# EAGLE design NotNightVision_r001 (EAGLE 7.5.0)
AUTHOR: Joshua Alexander; REVISION: 001

## Sheet 1 of 2
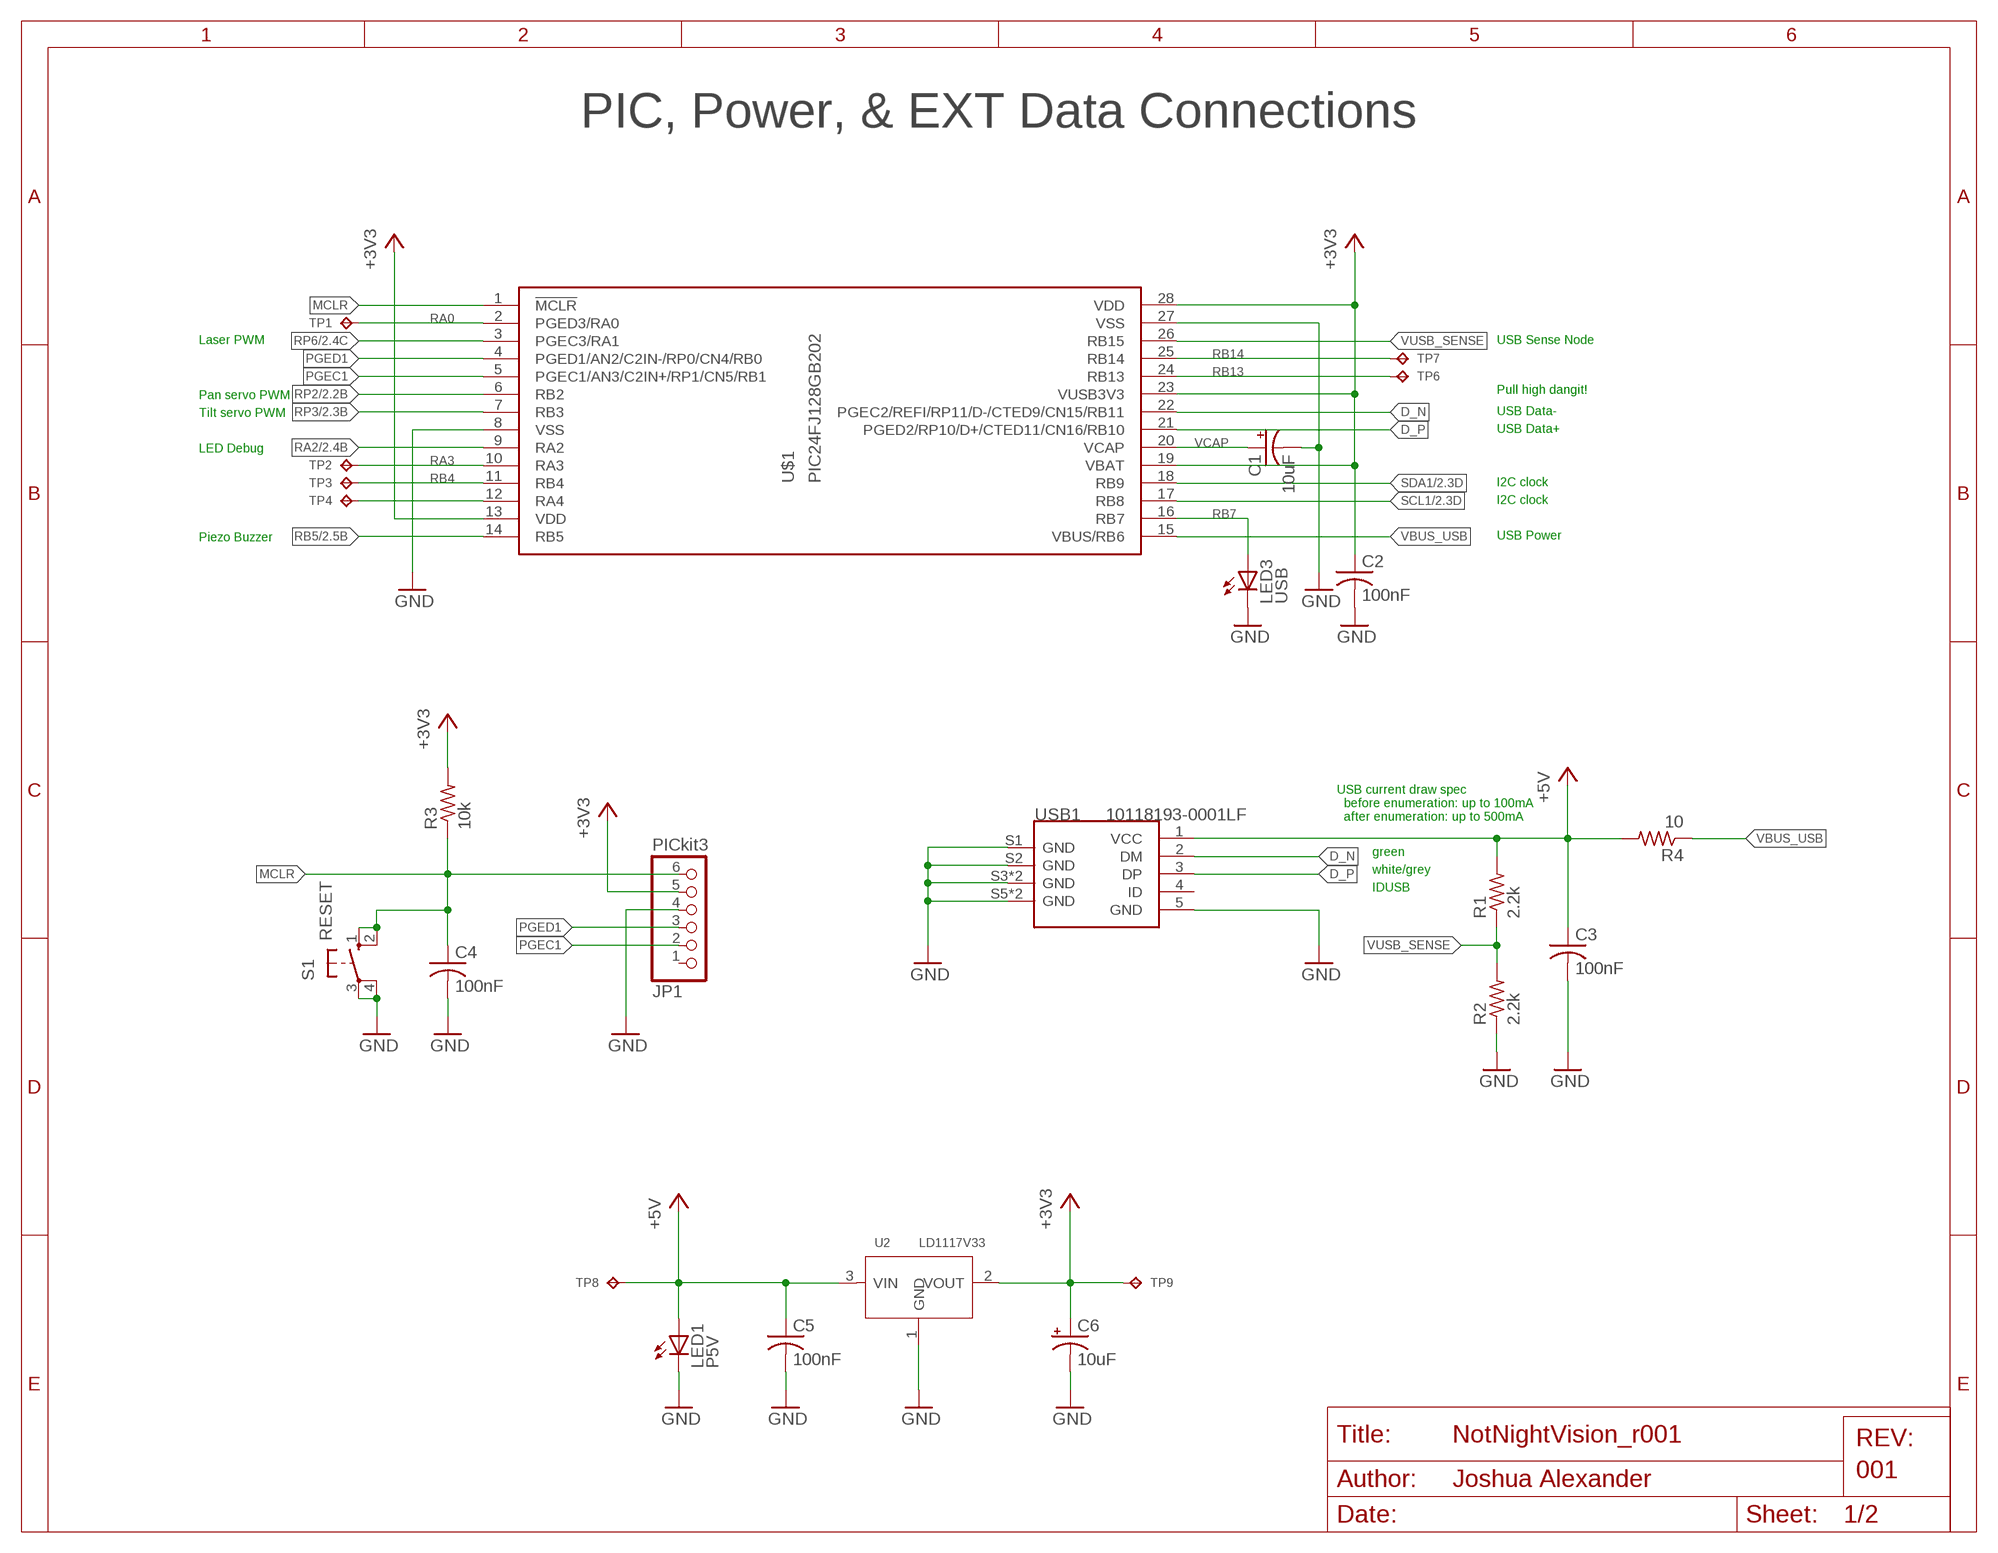
[diagram p0: schematic, sheet 1]

### Parts
C1  10uF  CPOL-USTT5D10  [TT5D10]
C2  100nF  C-US025-025X050  [C025-025X050]
C3  100nF  C-US025-025X050  [C025-025X050]
C4  100nF  C-US025-025X050  [C025-025X050]
C5  100nF  C-US025-025X050  [C025-025X050]
C6  10uF  CPOL-USTT5D10  [TT5D10]
JP1  PICkit3  PINHD-1X6/90  [1X06/90]
LED1  P5V  LED5MM  [LED5MM]
LED3  USB  LED3MM  [LED3MM]
R1  2.2k  R-US_0207/7  [0207/7]
R2  2.2k  R-US_0207/7  [0207/7]
R3  10k  R-US_0207/7  [0207/7]
R4  10  R-US_0207/7  [0207/7]
S1  RESET  10-XX  [B3F-10XX]
TP1  TP10  [10MIL_ROUND]
TP2  TP10  [10MIL_ROUND]
TP3  TP10  [10MIL_ROUND]
TP4  TP10  [10MIL_ROUND]
TP6  TP10  [10MIL_ROUND]
TP7  TP10  [10MIL_ROUND]
TP8  TP10  [10MIL_ROUND]
TP9  TP10  [10MIL_ROUND]
U2  LD1117V33  LD1117V33TO220V  [TO-220V]
U$1  PIC24FJ128GB202  [DIL28-3]
USB1  10118193-0001LF  MICRO-USB-SMD-B-(10118193-0001LF)  [MICRO-USB5+6P-SMD-0.65-B]

### Nets
+3V3 [power]: C2.1 C6.+ JP1.5 R3.2 TP9.TP U2.2(VOUT) U$1.13(VDD) U$1.19(VBAT) U$1.23(VUSB3V3) U$1.28(VDD) ; also sheet 2
+5V [power]: C3.1 C5.1 LED1.A R1.2 R4.2 TP8.TP U2.3(VIN) USB1.1(VCC) ; also sheet 2
D_N [usb]: U$1.22(PGEC2/REFI/RP11/D-/CTED9/CN15/RB11) USB1.2(DM)
D_P [usb]: U$1.21(PGED2/RP10/D+/CTED11/CN16/RB10) USB1.3(DP)
GND [power]: C1.- C2.2 C3.2 C4.2 C5.2 C6.- JP1.4 LED1.K(C) LED3.K(C) R2.1 S1.3(P) S1.4(P1) U2.1(GND) U$1.8(VSS) U$1.27(VSS) USB1.5(GND) USB1.S1(GND) USB1.S2(GND) USB1.S3(GND) USB1.S4(GND) USB1.S5(GND) USB1.S6(GND) ; also sheet 2
MCLR: C4.1 JP1.6 R3.1 S1.1(S) S1.2(S1) U$1.1(!MCLR)
PGEC1: JP1.2 U$1.5(PGEC1/AN3/C2IN+/RP1/CN5/RB1)
PGED1: JP1.3 U$1.4(PGED1/AN2/C2IN-/RP0/CN4/RB0)
RA0: TP1.TP U$1.2(PGED3/RA0)
RA2: U$1.9(RA2) ; also sheet 2
RA3: TP2.TP U$1.10(RA3)
RA4: TP4.TP U$1.12(RA4)
RB4: TP3.TP U$1.11(RB4)
RB5: U$1.14(RB5) ; also sheet 2
RB7: LED3.A U$1.16(RB7)
RB13: TP6.TP U$1.24(RB13)
RB14: TP7.TP U$1.25(RB14)
RP2: U$1.6(RB2) ; also sheet 2
RP3: U$1.7(RB3) ; also sheet 2
RP6: U$1.3(PGEC3/RA1) ; also sheet 2
SCL1: U$1.17(RB8) ; also sheet 2
SDA1: U$1.18(RB9) ; also sheet 2
VBUS_USB: R4.1 U$1.15(VBUS/RB6)
VCAP: C1.+ U$1.20(VCAP)
VUSB_SENSE: R1.1 R2.2 U$1.26(RB15)
Unconnected: JP1.1 USB1.4(ID)

### Notes on the sheet
- Laser PWM | USB Sense Node
- Pull high dangit!
- Pan servo PWM
- Tilt servo PWM | USB Data-
- USB Data+
- LED Debug
- I2C clock
- I2C clock
- Piezo Buzzer | USB Power
- USB current draw spec
    before enumeration: up to 100mA
    after enumeration: up to 500mA
- green
- white/grey
- IDUSB

## Sheet 2 of 2
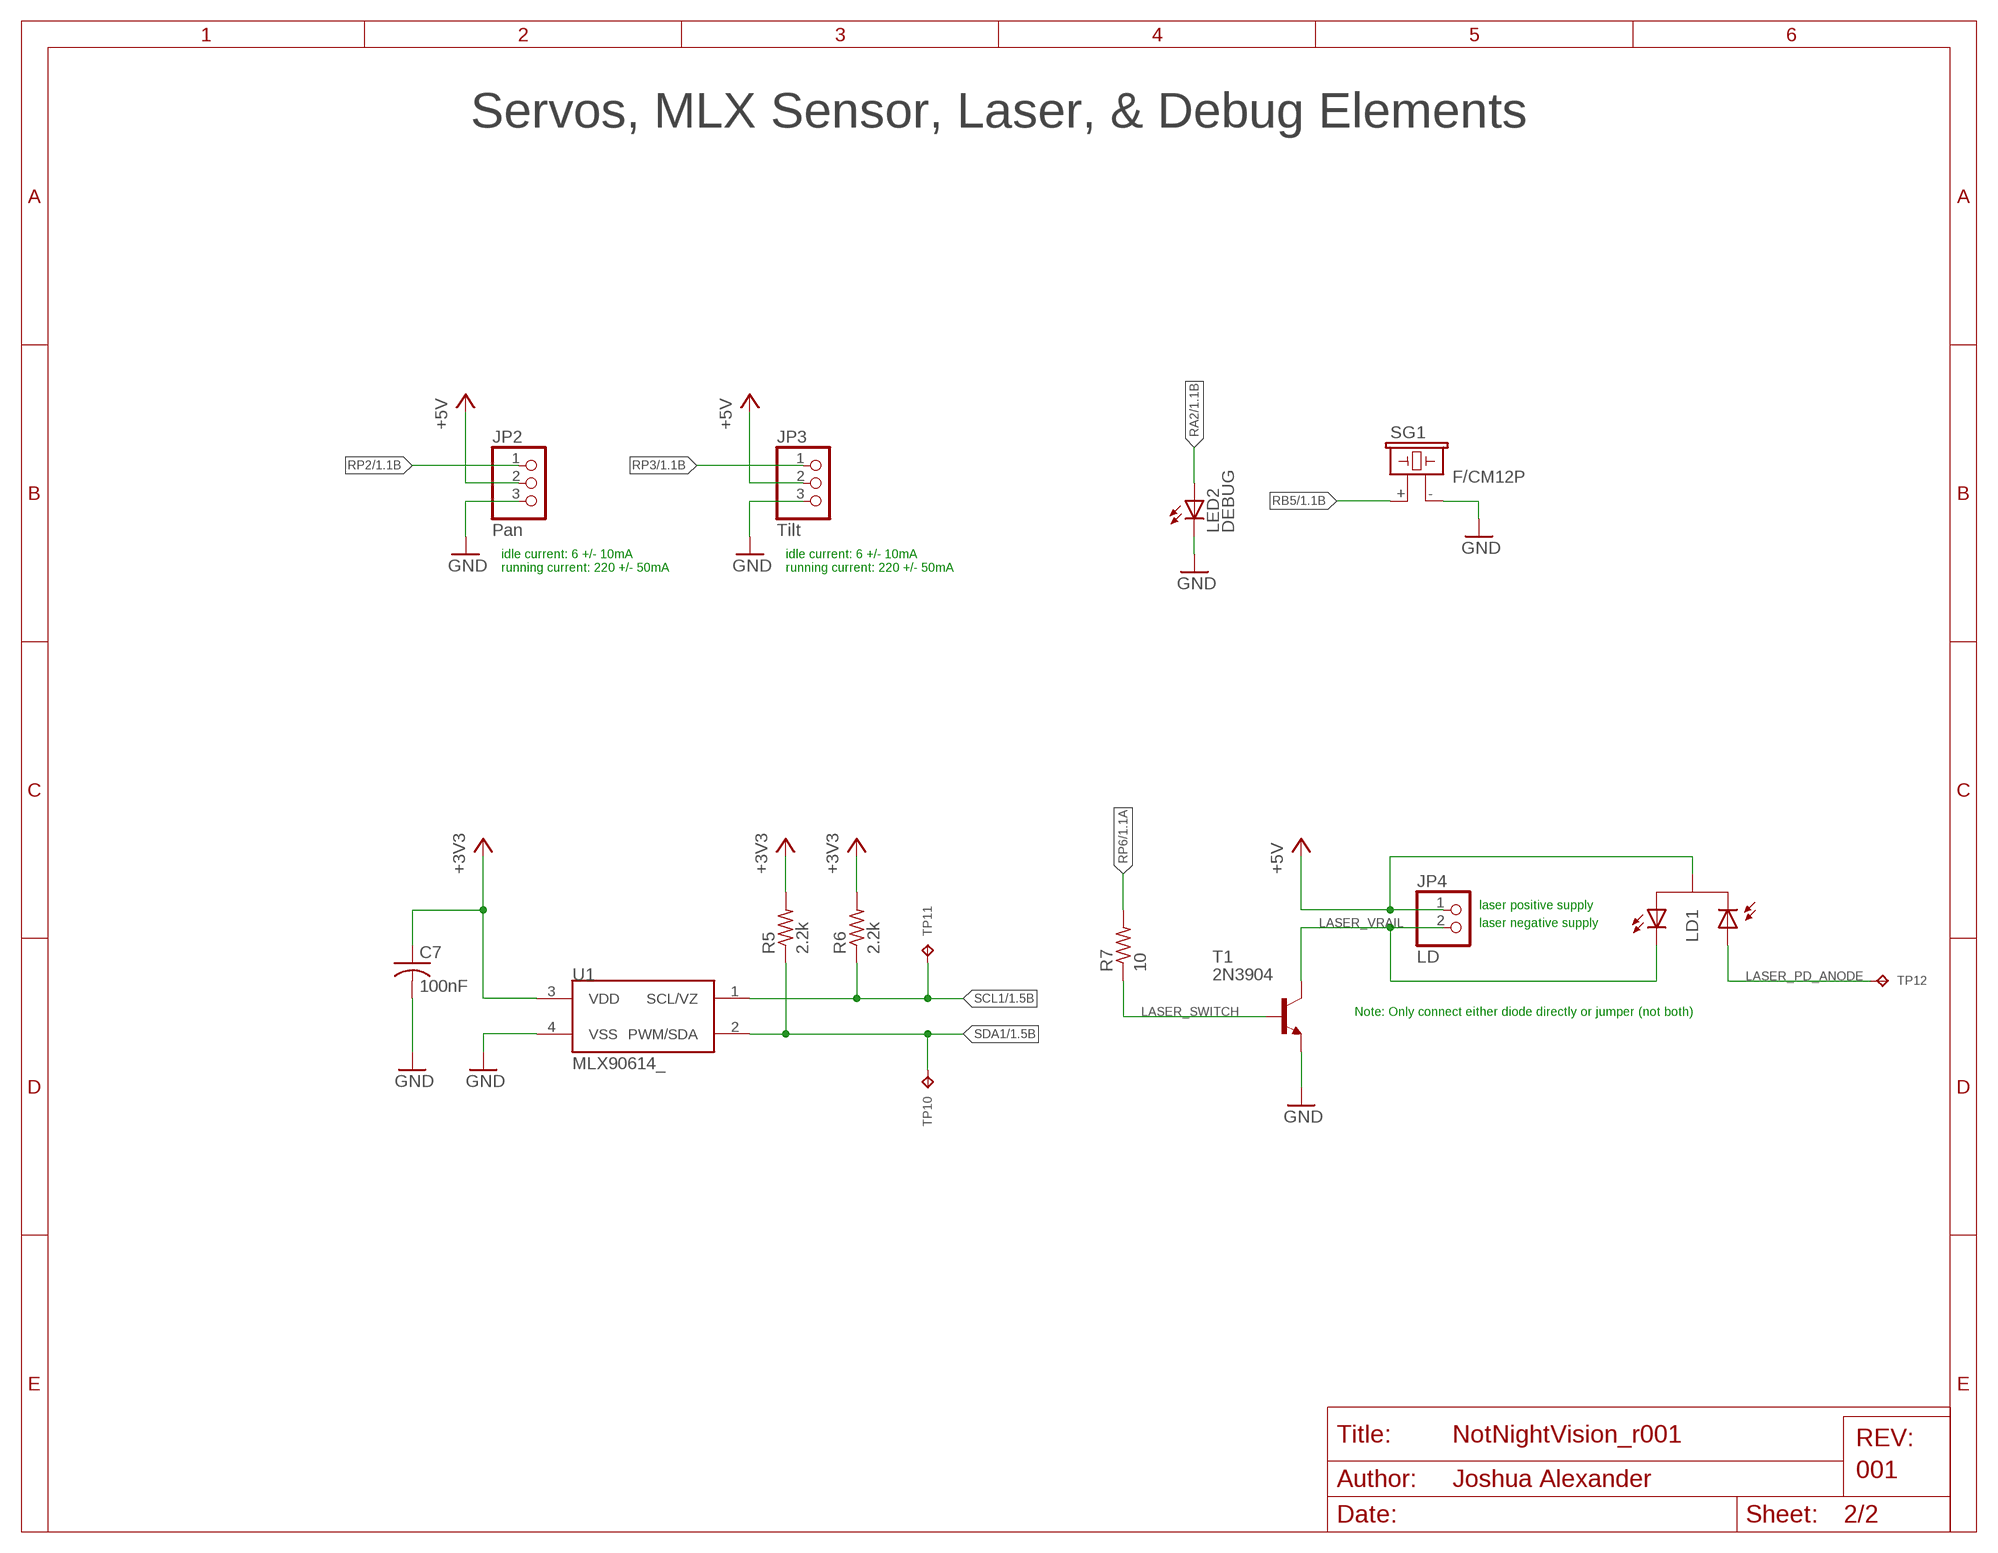
[diagram p1: schematic, sheet 2]

### Parts
C7  100nF  C-US025-025X050  [C025-025X050]
JP2  Pan  PINHD-1X3  [1X03]
JP3  Tilt  PINHD-1X3  [1X03]
JP4  LD  PINHD-1X2  [1X02]
LD1  LASER_DIODE  [TO-18]
LED2  DEBUG  LED3MM  [LED3MM]
R5  2.2k  R-US_0207/7  [0207/7]
R6  2.2k  R-US_0207/7  [0207/7]
R7  10  R-US_0207/7  [0207/7]
SG1  F/CM12P  [F/CM12P]
T1  2N3904  [TO92]
TP10  TP10  [10MIL_ROUND]
TP11  TP10  [10MIL_ROUND]
TP12  TP10  [10MIL_ROUND]
U1  MLX90614_  [TO-39]

### Nets
+3V3 [power]: C7.1 R5.2 R6.2 U1.3(VDD) ; also sheet 1
+5V [power]: JP2.2 JP3.2 JP4.1 LD1.2(V) ; also sheet 1
GND [power]: C7.2 JP2.3 JP3.3 LED2.K(C) SG1.- T1.3(E) U1.4(VSS) ; also sheet 1
LASER_PD_ANODE: LD1.3(D+) TP12.TP
LASER_SWITCH: R7.1 T1.2(B)
LASER_VRAIL: JP4.2 LD1.1(D-) T1.1(C)
RA2: LED2.A ; also sheet 1
RB5: SG1.+ ; also sheet 1
RP2: JP2.1 ; also sheet 1
RP3: JP3.1 ; also sheet 1
RP6: R7.2 ; also sheet 1
SCL1: R6.1 TP11.TP U1.1(SCL/VZ) ; also sheet 1
SDA1: R5.1 TP10.TP U1.2(PWM/SDA) ; also sheet 1

### Notes on the sheet
- idle current: 6 +/- 10mA
  running current: 220 +/- 50mA
- idle current: 6 +/- 10mA
  running current: 220 +/- 50mA
- laser positive supply
- laser negative supply
- Note: Only connect either diode directly or jumper (not both)

## Library data of the parts
C1 C6 = rcl:CPOL-US: POLARIZED CAPACITOR, American symbol; OC_NEWARK: unknown
C2-C5 C7 = rcl:C-US: CAPACITOR, American symbol; OC_NEWARK: unknown
JP1 = pinhead:PINHD-1X6: PIN HEADER
JP2 JP3 = pinhead:PINHD-1X3: PIN HEADER
JP4 = pinhead:PINHD-1X2: PIN HEADER
LD1 = custom:LASER_DIODE
LED1-LED3 = led:LED: LED OSRAM: - CHIPLED LG R971, LG N971, LY N971, LG Q971, LY Q971, LO R971, LY R971 LH N974, LH R974 LS Q976, LO Q976, LY Q976 LO Q996 - Hyper CHIPLED LW Q18S LB Q993, LB Q99A, LB R99A - SideLED LS A670, LO A670, LY A670, LG A670, LP A670 LB A673, LV A673, LT A673, LW A673 LH A674 LY A675 LS A676, LA A676, LO A676, LY A676, LW A676 LS A679, LY A679, LG A679 - Hyper Micro SIDELED® LS Y876, LA Y876, LO Y876, LY Y876 LT Y87S - SmartLED LW L88C, LW L88S LB L89C, LB L89S, LG L890 LS L89K, LO L89K, LY L89K LS L896, LA L896, LO L896, LY L896 - TOPLED LS T670, LO T670, LY T670, LG T670, LP T670 LSG T670, LSP T670, LSY T670, LOP T670, LYG T670 LG T671, LOG T671, LSG T671 LB T673, LV T673, LT T673, LW T673 LH T674 LS T676, LA T676, LO T676, LY T676, LB T676, LH T676, LSB T676, LW T676 LB T67C, LV T67C, LT T67C, LS T67K, LO T67K, LY T67K, LW E67C LS E67B, LA E67B, LO E67B, LY E67B, LB E67C, LV E67C, LT E67C LW T67C LS T679, LY T679, LG T679 LS T770, LO T770, LY T770, LG T770, LP T770 LB T773, LV T773, LT T773, LW T773 LH T774 LS E675, LA E675, LY E675, LS T675 LS T776, LA T776, LO T776, LY T776, LB T776 LHGB T686 LT T68C, LB T68C - Hyper Mini TOPLED® LB M676 - Mini TOPLED Santana® LG M470 LS M47K, LO M47K, LY M47K Source: http://www.osram.convergy.de LUXEON: - LUMILED® LXK2-PW12-R00, LXK2-PW12-S00, LXK2-PW14-U00, LXK2-PW14-V00 LXK2-PM12-R00, LXK2-PM12-S00, LXK2-PM14-U00 LXK2-PE12-Q00, LXK2-PE12-R00, LXK2-PE12-S00, LXK2-PE14-T00, LXK2-PE14-U00 LXK2-PB12-K00, LXK2-PB12-L00, LXK2-PB12-M00, LXK2-PB14-N00, LXK2-PB14-P00, LXK2-PB14-Q00 LXK2-PR12-L00, LXK2-PR12-M00, LXK2-PR14-Q00, LXK2-PR14-R00 LXK2-PD12-Q00, LXK2-PD12-R00, LXK2-PD12-S00 LXK2-PH12-R00, LXK2-PH12-S00 LXK2-PL12-P00, LXK2-PL12-Q00, LXK2-PL12-R00 Source: www.luxeon.com KINGBRIGHT: KA-3528ASYC Source: www.kingbright.com
R1-R7 = rcl:R-US_: RESISTOR, American symbol; OC_NEWARK: unknown
S1 = switch-omron:10-XX: OMRON SWITCH; MPN: B3F-1000; OC_FARNELL: 176432; OC_NEWARK: 36M3542
SG1 = buzzer:F/CM12P: BUZZER Source: Buerklin; OC_FARNELL: unknown; OC_NEWARK: unknown
T1 = transistor:2N3904: NPN TRANSISTOR
TP1-TP4 TP6-TP12 = custom:TP: Test pad
U1 = SparkFun-Sensors:MLX90614: Non-contact PIR I2C interface temperature sensor; MPN: 1747; OC_NEWARK: 28Y4967
U2 = custom:LD1117V33: 310030025
U$1 = custom:PIC24FJ128GB202; OC_NEWARK: unknown
USB1 = Seeed-OPL-Connector:MICRO-USB-SMD-B-(10118193-0001LF): 320010003; MPN: 10118193-0001LF; OC_NEWARK: 67T2259

## Net classes
0 default: width 0.203 mm, drill 0.381 mm, clearance 0.203 mm
1 power: width 0.381 mm, drill 0.381 mm, clearance 0.203 mm
2 usb: width 0.191 mm, drill 0.381 mm, clearance 0.203 mm

## Board
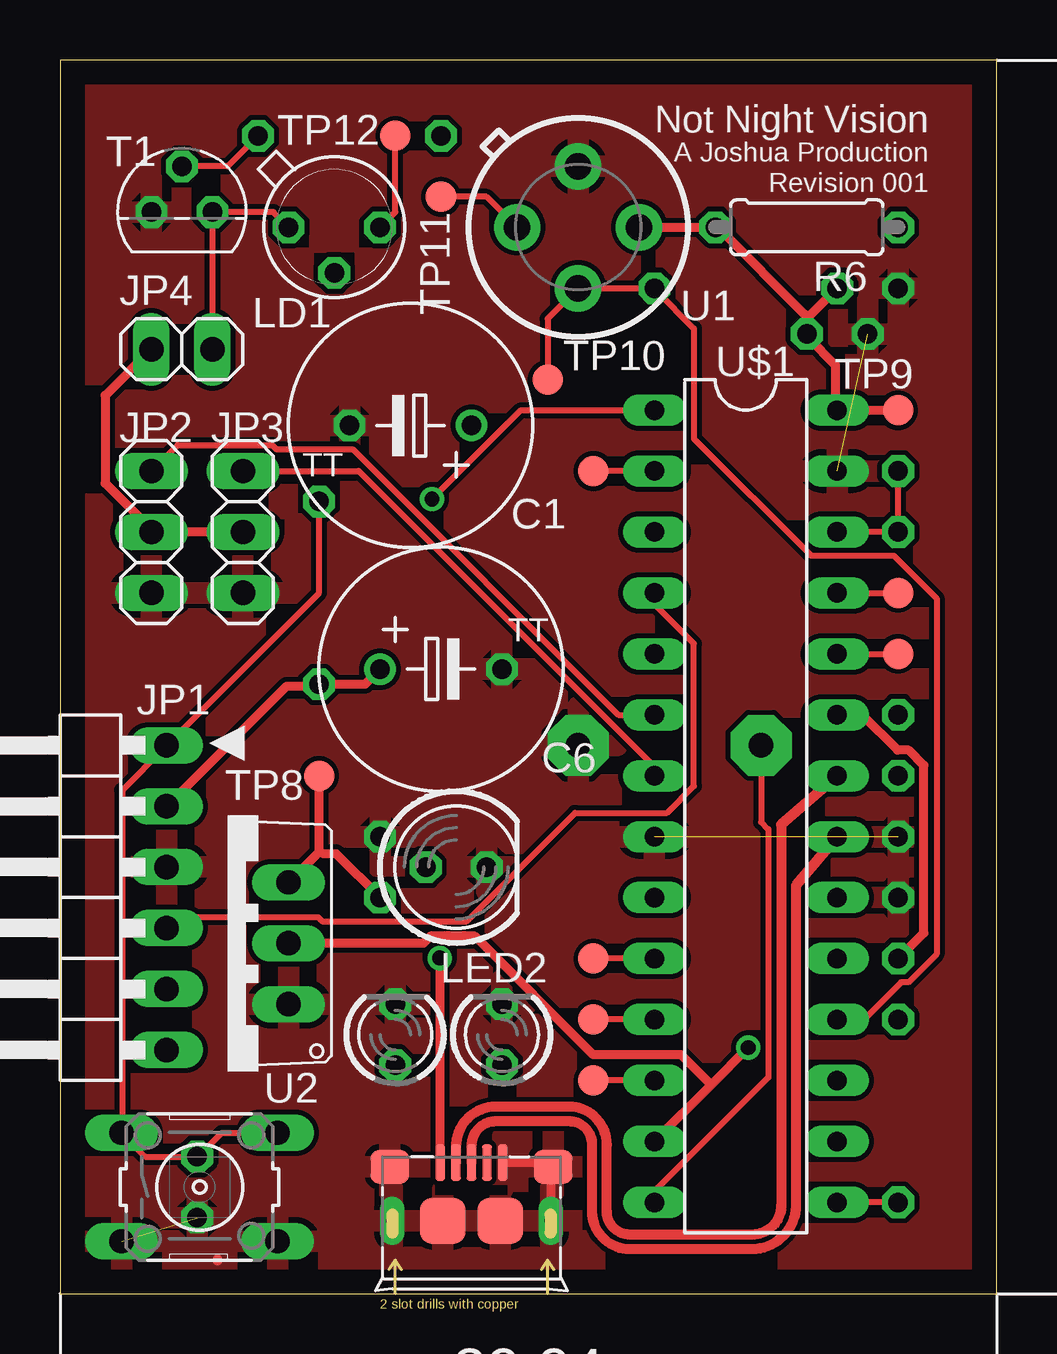
[diagram p2: board, top side]
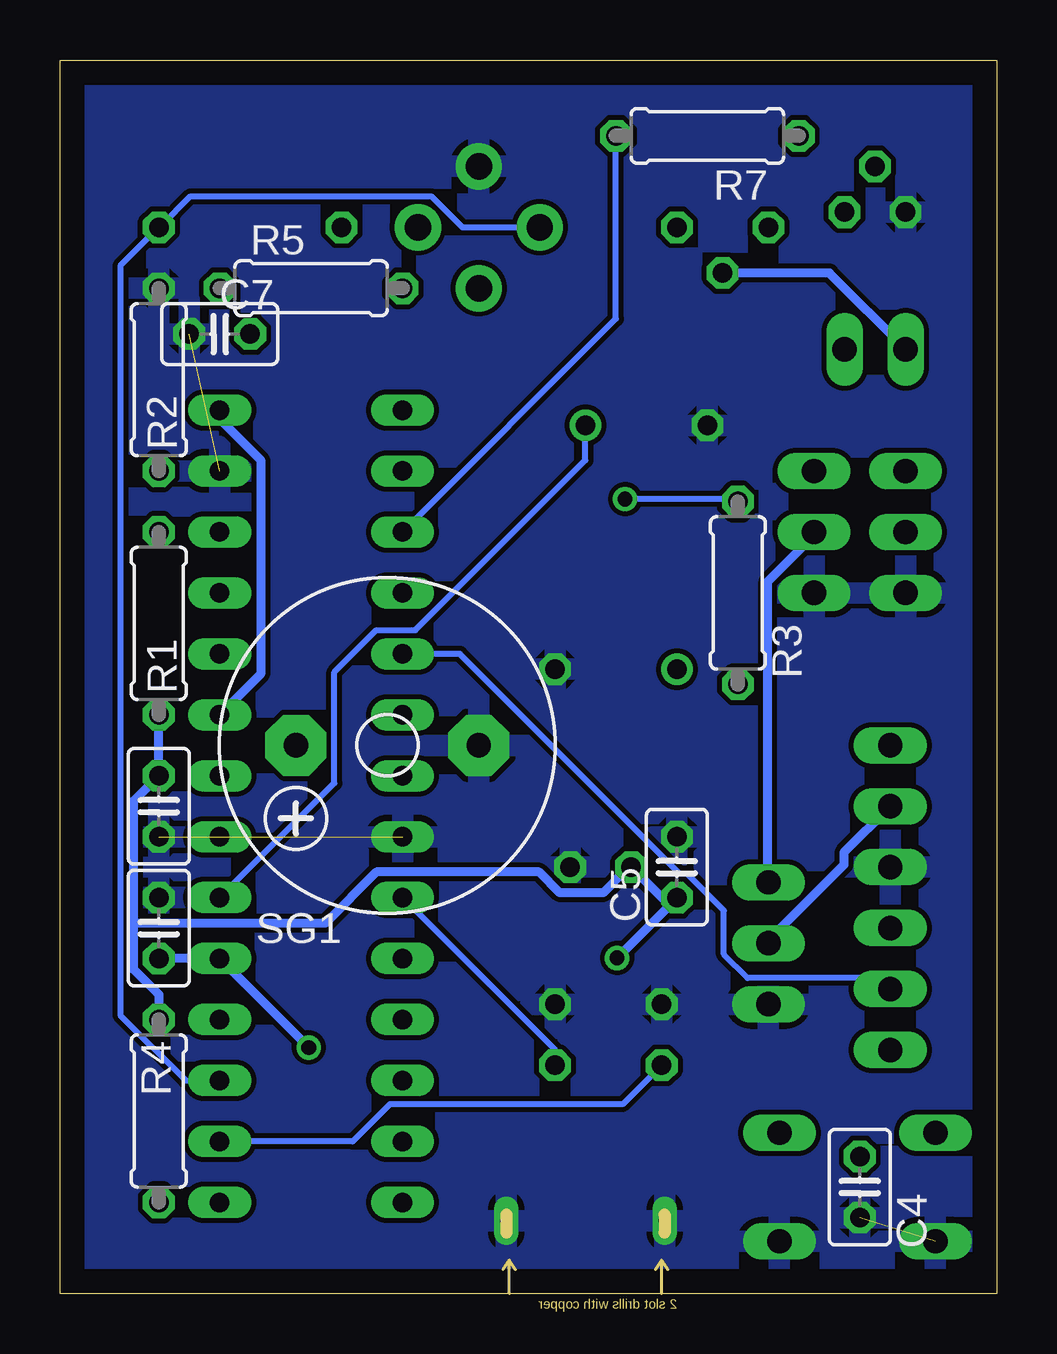
[diagram p3: board, bottom side, seen from below]

Size 39.04 x 51.42 mm. Coordinates in mm from the lower left corner, seen from the top.
Outline: 0,0 39.04,0 39.04,51.42 0,51.42 0,0
Copper layers (1*16): Top 0.035mm / dielectric 1.5mm / Bottom 0.035mm
Design rules "default": minimum track width 10mil, minimum drill 24mil, track to track 8mil, track to pad 8mil, pad to pad 8mil, via to via 8mil, smd to smd 8mil, copper to edge 40mil, drill to drill 8mil, minimum pad ring 10mil, minimum via ring 8mil, stop-mask expansion 4mil, vias tented up to drill 0mil, thermal gap 10mil

### Footprints (pad centres in the part's own frame; a part is rotated, then mirrored left to right if it is on the bottom)
TT5D10 = drill 0.813: + -2.54,0 | drill 0.813 octagon: - 2.54,0
C025-025X050 = drill 0.813 octagon: 1 -1.27,0; 2 1.27,0
1X06/90 = drill 1.016 long: 1 -6.35,-3.81; 2 -3.81,-3.81; 3 -1.27,-3.81; 4 1.27,-3.81; 5 3.81,-3.81; 6 6.35,-3.81
1X03 = drill 1.016 long: 1 -2.54,0; 2 0,0; 3 2.54,0
1X02 = drill 1.016 long: 1 -1.27,0; 2 1.27,0
TO-18 = drill 0.813 octagon: 1 1.905,0; 2 0,1.905; 3 -1.905,0
LED5MM = drill 0.813 octagon: A -1.27,0; K 1.27,0
LED3MM = drill 0.813 octagon: A -1.27,0; K 1.27,0
0207/7 = drill 0.813 octagon: 1 -3.81,0; 2 3.81,0
B3F-10XX = drill 1.016 long: 1 -3.251,2.261; 2 3.251,2.261; 3 -3.251,-2.261; 4 3.251,-2.261
F/CM12P = drill 1.016 pad 2.54 octagon: + 3.81,0; - -3.81,0
TO92 = drill 0.813 octagon: 1 1.27,0; 2 0,1.905; 3 -1.27,0
10MIL_ROUND = smd 1.27 x 1.27: TP 0,0
TO-39 = drill 1.1 pad 1.93: 1 2.54,0; 2 0,2.54; 3 -2.54,0; 4 0,-2.54
TO-220V = drill 1.016 long: 1 -2.54,-2.54; 2 0,-2.54; 3 2.54,-2.54
DIL28-3 = drill 0.813 long: 1 -16.51,-3.81; 2 -13.97,-3.81; 3 -11.43,-3.81; 4 -8.89,-3.81; 5 -6.35,-3.81; 6 -3.81,-3.81; 7 -1.27,-3.81; 8 1.27,-3.81; 9 3.81,-3.81; 10 6.35,-3.81; 11 8.89,-3.81; 12 11.43,-3.81; 13 13.97,-3.81; 14 16.51,-3.81; 15 16.51,3.81; 16 13.97,3.81; 17 11.43,3.81; 18 8.89,3.81; 19 6.35,3.81; 20 3.81,3.81; 21 1.27,3.81; 22 -1.27,3.81; 23 -3.81,3.81; 24 -6.35,3.81; 25 -8.89,3.81; 26 -11.43,3.81; 27 -13.97,3.81; 28 -16.51,3.81
MICRO-USB5+6P-SMD-0.65-B = smd 0.4 x 1.5: 1 -1.3,-0.25; 2 -0.65,-0.25; 3 0,-0.25; 4 0.65,-0.25; 5 1.3,-0.25 | smd 1.6 x 1.4: S1 -3.4,-0.427; S6 3.4,-0.427 | drill 0.508 pad 1.016 long: S2 -3.3,-2.675; S5 3.3,-2.675 | smd 1.9 x 1.9: S3 -1.2,-2.675; S4 1.2,-2.675

### Placement (x,y rotation side)
C1  14.61,36.2 180 top
C2  34.92,15.24 90 bottom
C3  34.92,20.32 270 bottom
C4  5.71,4.45 270 bottom
C5  13.33,17.78 90 bottom
C6  15.88,26.04 0 top
C7  32.38,40 180 bottom
JP1  0.64,16.51 90 top
JP2  3.81,31.75 270 top
JP3  7.62,31.75 270 top
JP4  5.08,39.37 0 top
LD1  11.43,44.45 180 top
LED1  16.51,17.78 0 top
LED2  18.42,10.79 90 top
LED3  13.97,10.79 90 top
R1  34.92,27.94 270 bottom
R2  34.92,38.1 270 bottom
R3  10.79,29.21 270 bottom
R4  34.92,7.62 90 bottom
R5  28.58,41.91 180 bottom
R6  31.12,44.45 180 top
R7  12.06,48.26 180 bottom
S1  5.82,4.45 0 top
SG1  25.4,22.86 180 bottom
T1  5.08,45.09 0 top
TP1  22.23,34.29 0 top
TP2  22.23,13.97 0 top
TP3  22.23,11.43 0 top
TP4  22.23,8.89 0 top
TP6  34.92,26.67 0 top
TP7  34.92,29.21 0 top
TP8  10.79,21.59 180 top
TP9  34.92,36.83 0 top
TP10  20.32,38.1 0 top
TP11  15.88,45.72 180 top
TP12  13.97,48.26 0 top
U1  21.59,44.45 180 top
U2  6.98,14.61 90 top
U$1  28.58,20.32 270 top
USB1  17.15,5.71 0 top

### Tracks (layer width: path | path; a pad name or v marks a point on that pad's centre or on a via)
+3V3  (via drill 0.61)
  Top 0.381: C6.+ 12.7,25.4 R3.2 10.62,25.32 9.45,25.32 JP1.5 | U1.3 R6.2 27.48,44.37 31.04,40.82 31.12,40.64 | TP9.TP U$1.28 32.31,37.01 32.31,38.71 31.19,39.83 C7.1 31.12,40.64 | R5.2 31.12,40.64 | v28.68,10.26 27.13,8.71 | 27.13,8.71 U$1.13 | U$1.23 33.43,24.13 34.9,22.66 35.36,22.66 35.99,22.02 35.99,15.04 C2.1 | U2.2 15.14,14.61 15.44,14.91 17.27,14.91 22.23,9.96 25.88,9.96 27.13,8.71
  Bottom 0.381: U2.2 9.53,14.73 6.38,17.88 6.38,18.39 JP1.5 | v28.68,10.26 U$1.19 C2.1 | U$1.28 32.38,36.45 30.66,34.72 30.66,25.86 U$1.23
+5V  (via drill 0.61)
  Top 0.381: JP3.2 JP2.2 3.73,31.93 1.88,33.78 1.88,37.44 JP4.1 | 10.79,18.42 TP8.TP | U2.3 10.79,18.42 | v15.82,13.99 15.82,5.49 USB1.1 | C5.1 11.51,18.34 10.97,18.34 10.79,18.42
  Bottom 0.381: LD1.2 6.98,42.54 JP4.1 | R4.2 34.92,12.47 35.99,13.54 35.99,15.44 | 35.99,15.44 35.99,20.52 C3.1 R1.2 | v15.82,13.99 13.33,16.48 C5.1 13.77,16.31 LED1.A 15.42,17.7 16.41,16.71 18.21,16.71 19.08,17.58 25.86,17.58 27.99,15.44 35.99,15.44 | JP3.2 7.62,31.62 9.55,29.69 9.55,17.17 U2.3
D_N
  Top 0.406: U$1.22 30.05,19.56 30.05,3.68 arc-90 28.83,2.46 23.75,2.46 arc-90 22.78,3.43 22.78,6.22 arc90 21.21,7.8 18.16,7.8 arc90 16.5,6.13 USB1.2
D_P
  Top 0.406: U$1.21 30.66,17.02 30.66,3.68 arc-90 28.83,1.85 23.75,1.85 arc-90 22.17,3.43 22.17,6.22 arc90 21.21,7.19 18.16,7.19 arc90 17.15,6.17 USB1.3
GND  (3 unrouted)
  Top 0.381: USB1.5 18.47,5.46 20.37,5.46 20.52,5.31 USB1.S6 20.47,5.1 20.47,3.07 USB1.S5 | 6.55,1.37 6.55,1.46
  pour Bottom: -1.91,53.34 -1.91,-2.54 41.27,-2.54 41.27,53.34
  pour Top: -0.64,52.07 -0.64,-1.27 40,-1.27 40,52.07
LASER_PD_ANODE
  Top 0.254: TP12.TP 13.97,45.09 LD1.3
LASER_SWITCH
  Top 0.254: T1.2 6.98,46.99 R7.1
LASER_VRAIL
  Top 0.254: LD1.1 8.89,45.09 T1.1 JP4.2
MCLR  (via drill 0.61)
  Top 0.254: S1.2 6.73,6.71 5.82,5.79 C4.1 3.56,5.71 S1.1 2.59,6.81 2.59,20.98 4.37,22.76 JP1.6 10.79,29.21 R3.1 | U$1.1 19.2,36.83 v15.49,33.12
  Bottom 0.254: v15.49,33.12 10.9,33.12 R3.1
PGEC1
  Bottom 0.254: U$1.5 22.38,26.67 13.21,17.5 12.9,17.5 11.38,15.98 11.38,14.15 10.39,13.16 4.9,13.16 JP1.2
PGED1
  Top 0.254: U$1.4 24.77,28.75 26.42,27.1 26.42,21.16 25.3,20.04 21.46,20.04 16.94,15.52 10.92,15.52 10.74,15.7 4.9,15.7 JP1.3
RA0
  Top 0.254: U$1.2 TP1.TP
RA2
  Bottom 0.254: LED2.A 18.42,10.16 U$1.9
RA3
  Top 0.254: U$1.10 TP2.TP
RA4
  Top 0.254: U$1.12 TP4.TP
RB4
  Top 0.254: U$1.11 TP3.TP
RB5
  Top 0.254: U$1.14 24.77,4.27 29.52,9.02 29.52,19.36 29.21,19.66 SG1.+
RB7
  Bottom 0.254: U$1.16 26.85,6.35 25.3,7.9 15.6,7.9 LED3.A
RB13
  Top 0.254: U$1.24 TP6.TP
RB14
  Top 0.254: U$1.25 TP7.TP
RP2
  Top 0.254: U$1.6 23.27,24.13 12.19,35.2 9.02,35.2 8.84,35.38 4.9,35.38 JP2.1
RP3
  Top 0.254: U$1.7 24.77,21.97 12.45,34.29 JP3.1
RP6
  Bottom 0.254: R7.2 15.88,40.64 U$1.3
SCL1
  Top 0.254: TP11.TP 17.78,45.72 U1.1
  Bottom 0.254: U$1.17 33.81,8.89 36.52,11.61 36.52,42.85 R6.1 34.82,44.53 33.6,45.74 23.57,45.74 22.28,44.45 U1.1
SDA1
  Top 0.254: TP10.TP 20.32,40.64 U1.2 R5.1 24.84,41.81 26.42,40.23 26.42,35.64 31.29,30.76 34.75,30.76 36.52,28.98 36.52,14.15 35.36,12.98 35.05,12.98 33.5,11.43 U$1.18
VBUS_USB
  Top 0.254: R4.1 U$1.15
VCAP
  Bottom 0.254: C1.+ 17.15,34.75 24.23,27.66 25.86,27.66 27.61,25.91 27.61,21.29 U$1.20
VUSB_SENSE
  Top 0.254: U$1.26 R1.1 R2.2

### Text on the board
tNames: Not Night Vision | A Joshua Production | Revision 001 | ◄